# EAGLE design 64 channel Standard Array EIB v1.1 (EAGLE 9.6.2)
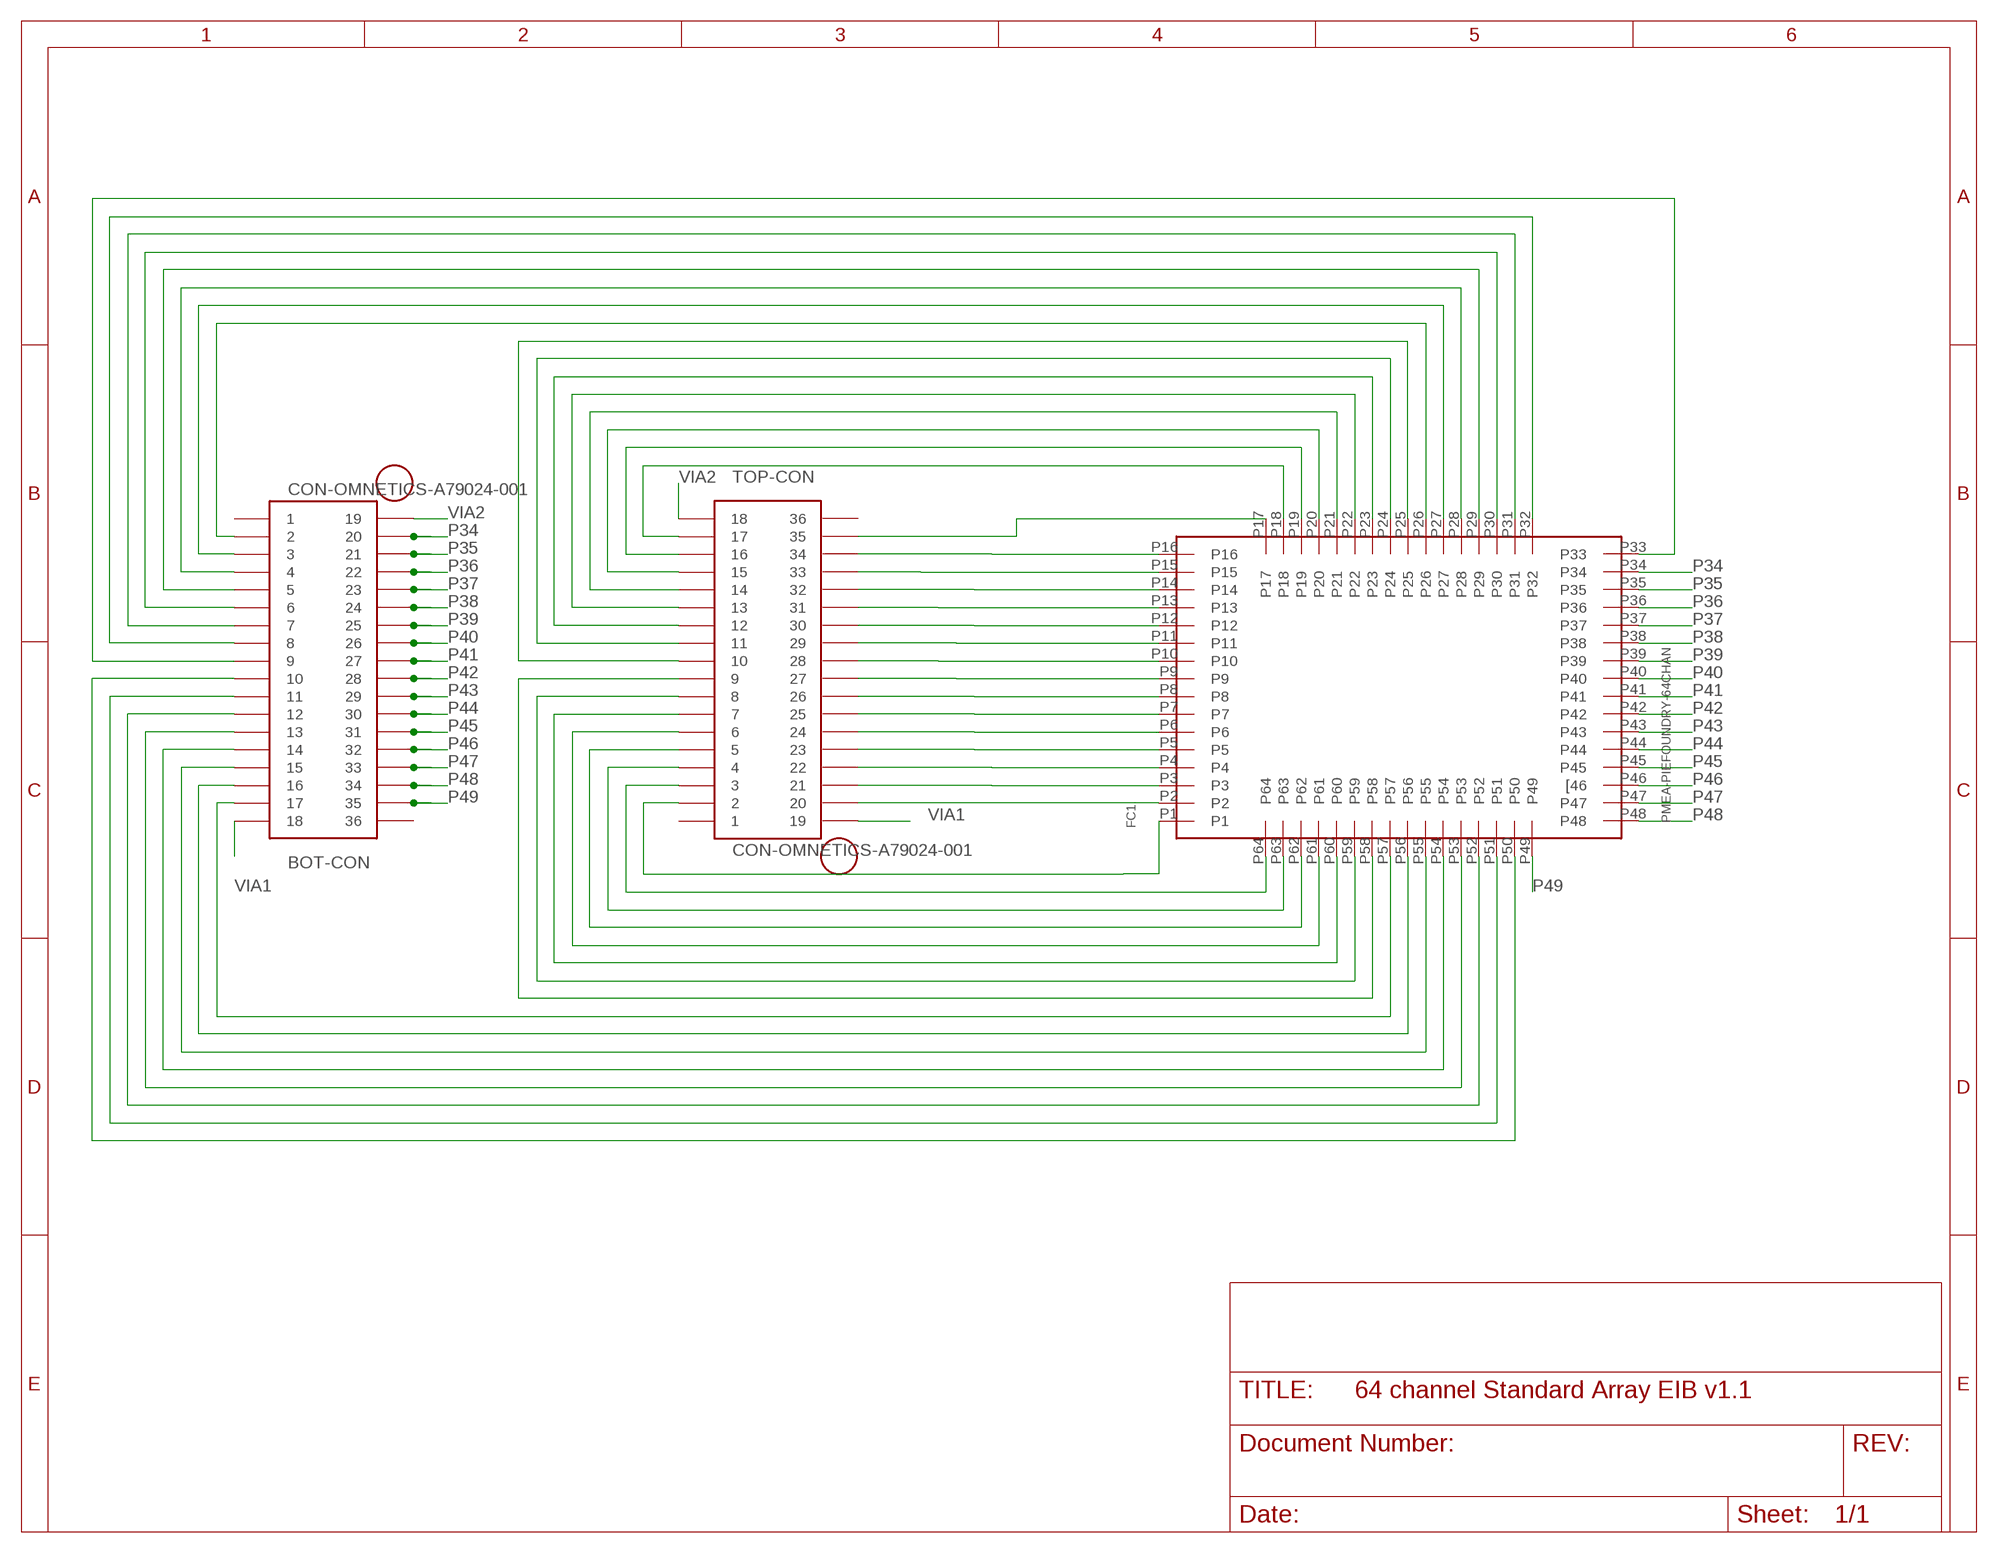
[diagram p0: schematic, sheet 1]

## Parts
BOT-CON  CON-OMNETICS-A79024-001  [CON-OMNETICS-A79024-001]
FC1  PMEA-PIEFOUNDRY-64CHAN  [PMEA-PIEFOUNDRY-64CHAN]
TOP-CON  CON-OMNETICS-A79024-001  [CON-OMNETICS-A79024-001]

## Nets
N$1: FC1.P17 TOP-CON.35
N$2: FC1.P16 TOP-CON.34
N$3: FC1.P15 TOP-CON.33
N$4: FC1.P14 TOP-CON.32
N$5: FC1.P13 TOP-CON.31
N$6: FC1.P12 TOP-CON.30
N$7: FC1.P11 TOP-CON.29
N$8: FC1.P10 TOP-CON.28
N$9: FC1.P9 TOP-CON.27
N$10: FC1.P8 TOP-CON.26
N$11: FC1.P7 TOP-CON.25
N$12: FC1.P6 TOP-CON.24
N$13: FC1.P5 TOP-CON.23
N$14: FC1.P4 TOP-CON.22
N$15: FC1.P3 TOP-CON.21
N$16: FC1.P2 TOP-CON.20
N$17: FC1.P18 TOP-CON.17
N$18: FC1.P19 TOP-CON.16
N$19: FC1.P20 TOP-CON.15
N$20: FC1.P21 TOP-CON.14
N$21: FC1.P22 TOP-CON.13
N$22: FC1.P23 TOP-CON.12
N$23: FC1.P24 TOP-CON.11
N$24: FC1.P25 TOP-CON.10
N$25: FC1.P1 TOP-CON.2
N$26: FC1.P64 TOP-CON.3
N$27: FC1.P63 TOP-CON.4
N$28: FC1.P62 TOP-CON.5
N$29: FC1.P61 TOP-CON.6
N$30: FC1.P60 TOP-CON.7
N$31: FC1.P59 TOP-CON.8
N$32: FC1.P58 TOP-CON.9
N$37: BOT-CON.2 FC1.P26
N$38: BOT-CON.3 FC1.P27
N$39: BOT-CON.4 FC1.P28
N$40: BOT-CON.5 FC1.P29
N$41: BOT-CON.6 FC1.P30
N$42: BOT-CON.7 FC1.P31
N$43: BOT-CON.8 FC1.P32
N$44: BOT-CON.9 FC1.P33
N$45: BOT-CON.17 FC1.P57
N$46: BOT-CON.16 FC1.P56
N$47: BOT-CON.15 FC1.P55
N$48: BOT-CON.14 FC1.P54
N$49: BOT-CON.13 FC1.P53
N$50: BOT-CON.12 FC1.P52
N$51: BOT-CON.11 FC1.P51
N$52: BOT-CON.10 FC1.P50
P34: BOT-CON.20 FC1.P34
P35: BOT-CON.21 FC1.P35
P36: BOT-CON.22 FC1.P36
P37: BOT-CON.23 FC1.P37
P38: BOT-CON.24 FC1.P38
P39: BOT-CON.25 FC1.P39
P40: BOT-CON.26 FC1.P40
P41: BOT-CON.27 FC1.P41
P42: BOT-CON.28 FC1.P42
P43: BOT-CON.29 FC1.P43
P44: BOT-CON.30 FC1.P44
P45: BOT-CON.31 FC1.P45
P46: BOT-CON.32 FC1.P46([46)
P47: BOT-CON.33 FC1.P47
P48: BOT-CON.34 FC1.P48
P49: BOT-CON.35 FC1.P49
VIA1: BOT-CON.18 TOP-CON.19
VIA2: BOT-CON.19 TOP-CON.18
Unconnected: BOT-CON.1 BOT-CON.36 TOP-CON.1 TOP-CON.36

## Library data of the parts
BOT-CON TOP-CON = con-omnetics:CON-OMNETICS-A79024-001: 36 Position Dual Row Male Nano-Miniature (.025″/.64mm) Connector; Featuring 4 Guide Posts and Horizontal Surface Mount Tails
FC1 = pmea-piefoundry:PMEA-PIEFOUNDRY-64CHAN: 64 channel polymer microelectrode array (pMEA) connector ; Connection requires 64 wirebond (soft-gold) pads for ultrasonic bump bonding; Legacy design maintained for compatibility with PIE Foundry Standard Array v1 3/25/25 Kee Scholten PIE Foundry @ USC

## Board
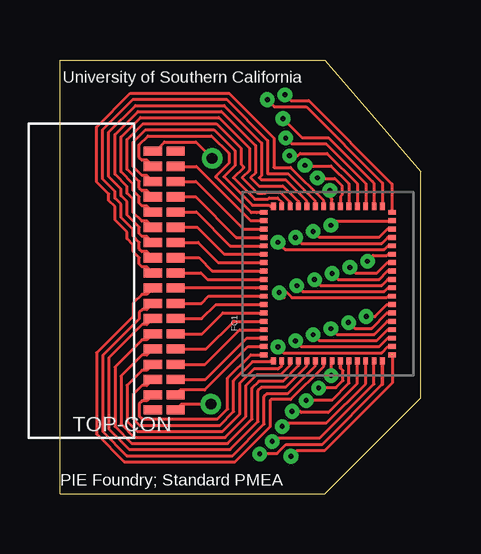
[diagram p1: board, top side]
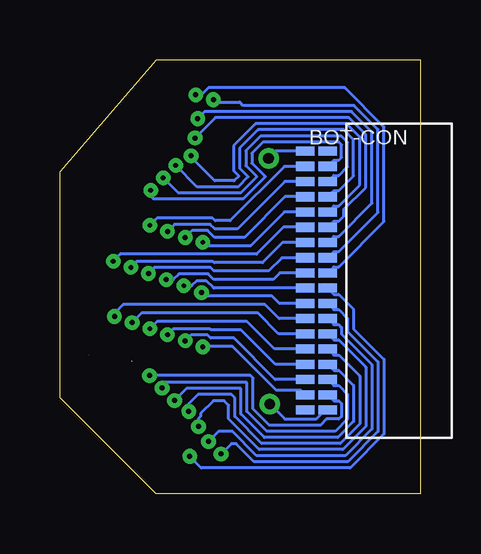
[diagram p2: board, bottom side, seen from below]

Size 15.05 x 18.1 mm. Coordinates in mm from the lower left corner, seen from the top.
Outline: 11.05,0 15.05,4 15.05,13.45 11.05,18.1 0,18.1 0,0 11.05,0
Copper layers (1*16): Top 0.035mm / dielectric 1.5mm / Bottom 0.035mm
Design rules "PIE-Probe *": minimum track width 5mil, minimum drill 8mil, track to track 5mil, track to pad 5mil, pad to pad 5mil, via to via 5mil, smd to smd 5mil, copper to edge 40mil, drill to drill 6mil, minimum pad ring 10mil, minimum via ring 8mil, stop-mask expansion 4mil, vias tented up to drill 0.3mm, thermal gap 10mil

### Footprints (pad centres in the part's own frame; a part is rotated, then mirrored left to right if it is on the bottom)
CON-OMNETICS-A79024-001 = smd 0.762 x 0.381: 1 1.88,-5.397; 2 1.88,-4.763; 3 1.88,-4.128; 4 1.88,-3.493; 5 1.88,-2.857; 6 1.88,-2.223; 7 1.88,-1.587; 8 1.88,-0.953; 9 1.88,-0.318; 10 1.88,0.318; 11 1.88,0.953; 12 1.88,1.587; 13 1.88,2.223; 14 1.88,2.857; 15 1.88,3.493; 16 1.88,4.128; 17 1.88,4.763; 18 1.88,5.397; 19 2.819,-5.397; 20 2.819,-4.763; 21 2.819,-4.128; 22 2.819,-3.493; 23 2.819,-2.857; 24 2.819,-2.223; 25 2.819,-1.587; 26 2.819,-0.953; 27 2.819,-0.318; 28 2.819,0.318; 29 2.819,0.953; 30 2.819,1.587; 31 2.819,2.223; 32 2.819,2.857; 33 2.819,3.493; 34 2.819,4.128; 35 2.819,4.763; 36 2.819,5.397
PMEA-PIEFOUNDRY-64CHAN = smd 0.2 x 0.3: P1 -2.975,2.675; P2 -2.625,2.675; P3 -2.275,2.675; P4 -1.925,2.675; P5 -1.575,2.675; P6 -1.225,2.675; P7 -0.875,2.675; P8 -0.525,2.675; P9 -0.175,2.675; P10 0.175,2.675; P11 0.525,2.675; P12 0.875,2.675; P13 1.225,2.675; P14 1.575,2.675; P15 1.925,2.675; P16 2.275,2.675; P17 2.625,2.675; P18 2.975,2.675; P33 2.975,-2.675; P34 2.625,-2.675; P35 2.275,-2.675; P36 1.925,-2.675; P37 1.575,-2.675; P38 1.225,-2.675; P39 0.875,-2.675; P40 0.525,-2.675; P41 0.175,-2.675; P42 -0.175,-2.675; P43 -0.525,-2.675; P44 -0.875,-2.675; P45 -1.225,-2.675; P46 -1.575,-2.675; P47 -1.925,-2.675; P48 -2.275,-2.675; P49 -2.625,-2.675; P50 -2.975,-2.675 | smd 0.3 x 0.2: P19 3.225,2.275; P20 3.225,1.925; P21 3.225,1.575; P22 3.225,1.225; P23 3.225,0.875; P24 3.225,0.525; P25 3.225,0.175; P26 3.225,-0.175; P27 3.225,-0.525; P28 3.225,-0.875; P29 3.225,-1.225; P30 3.225,-1.575; P31 3.225,-1.925; P32 3.225,-2.275; P51 -3.225,-2.275; P52 -3.225,-1.925; P53 -3.225,-1.575; P54 -3.225,-1.225; P55 -3.225,-0.875; P56 -3.225,-0.525; P57 -3.225,-0.175; P58 -3.225,0.175; P59 -3.225,0.525; P60 -3.225,0.875; P61 -3.225,1.225; P62 -3.225,1.575; P63 -3.225,1.925; P64 -3.225,2.275

### Placement (x,y rotation side)
BOT-CON  2,8.9 180 bottom
FC1  11.18,8.78 90 top
TOP-CON  2,8.9 0 top

### Tracks (layer width: path | path; a pad name or v marks a point on that pad's centre or on a via)
N$1
  Top 0.127: TOP-CON.35 5.69,13.66 7.95,11.4 FC1.P17
N$2
  Top 0.127: TOP-CON.34 5.67,13.03 7.65,11.05 FC1.P16
N$3
  Top 0.127: TOP-CON.33 5.66,12.39 7.35,10.7 FC1.P15
N$4
  Top 0.127: TOP-CON.32 5.69,11.76 7.1,10.35 FC1.P14
N$5
  Top 0.127: TOP-CON.31 5.73,11.12 6.85,10 FC1.P13
N$6
  Top 0.127: TOP-CON.30 5.76,10.49 6.6,9.65 FC1.P12
N$7
  Top 0.127: TOP-CON.29 5.8,9.85 6.35,9.3 FC1.P11
N$8
  Top 0.127: TOP-CON.28 5.88,9.22 6.15,8.95 FC1.P10
N$9
  Top 0.127: TOP-CON.27 8.18,8.58 8.48,8.58 FC1.P9
N$10
  Top 0.127: TOP-CON.26 5.9,7.95 6.2,8.25 FC1.P8
N$11
  Top 0.127: TOP-CON.25 5.91,7.31 6.5,7.9 FC1.P7
N$12
  Top 0.127: TOP-CON.24 5.93,6.68 6.8,7.55 FC1.P6
N$13
  Top 0.127: TOP-CON.23 6.09,6.04 7.25,7.2 FC1.P5
N$14
  Top 0.127: TOP-CON.22 6.06,5.41 7.45,6.8 7.5,6.85 FC1.P4
N$15
  Top 0.127: TOP-CON.21 6.07,4.77 7.8,6.5 FC1.P3
N$16
  Top 0.127: TOP-CON.20 5.02,4.34 6.04,4.34 7.85,6.15 FC1.P2
N$17
  Top 0.127: TOP-CON.17 3.63,13.92 3.42,13.92 3.31,14.03 3.31,14.57 3.67,14.93 6.32,14.93 7.04,14.21 7.04,13.79 6.5,13.25 6.5,13.21 7.98,11.73 8.2,11.73 8.48,11.73 FC1.P18
N$18
  Top 0.127: TOP-CON.16 3.63,13.28 3.42,13.28 3.05,13.65 3.05,14.67 3.57,15.19 6.42,15.19 7.3,14.31 7.3,13.69 6.84,13.23 8.03,12.04 8.73,12.04 8.77,12 FC1.P19
N$19
  Top 0.127: TOP-CON.15 3.63,12.65 3.42,12.65 3.31,12.76 3.31,13.03 2.8,13.54 2.8,14.78 3.46,15.44 6.53,15.44 7.55,14.42 7.55,13.75 7.65,13.65 7.65,13.6 7.24,13.19 8.13,12.29 8.68,12.29 8.72,12.34 9.08,12.34 9.25,12.17 FC1.P20
N$20
  Top 0.127: TOP-CON.14 3.63,12.01 3.42,12.01 3.31,12.12 3.31,12.4 3.05,12.65 3.05,12.93 2.55,13.44 2.55,14.88 3.36,15.69 6.63,15.69 7.9,14.42 7.9,13.49 7.6,13.19 8.24,12.55 8.57,12.55 8.62,12.6 9.18,12.6 9.6,12.18 FC1.P21
N$21
  Top 0.127: TOP-CON.13 3.63,11.38 3.42,11.38 3.05,11.74 3.05,12.29 2.8,12.55 2.8,12.82 2.29,13.33 2.29,14.99 3.25,15.95 6.74,15.95 8.16,14.53 8.16,13.39 7.96,13.19 8.3,12.85 9.3,12.85 9.95,12.2 FC1.P22
N$22
  Top 0.127: TOP-CON.12 3.63,10.74 3.42,10.74 3.31,10.85 3.31,11.13 2.8,11.64 2.8,12.19 2.55,12.44 2.55,12.72 2.04,13.23 2.04,15.09 3.15,16.2 6.84,16.2 8.41,14.63 8.41,13.28 8.32,13.19 8.4,13.1 9.4,13.1 10.3,12.21 FC1.P23
N$23
  Top 0.127: TOP-CON.11 3.63,10.11 3.42,10.11 3.31,10.22 3.31,10.49 3.05,10.75 3.05,11.02 2.55,11.53 2.55,12.08 2.29,12.34 2.29,12.61 1.78,13.12 1.78,15.2 3.04,16.46 6.95,16.46 8.67,14.74 8.67,13.36 9.51,13.36 10.65,12.22 FC1.P24
N$24
  Top 0.127: TOP-CON.10 3.63,9.47 3.42,9.47 3.31,9.58 3.31,9.86 3.05,10.11 3.05,10.39 2.8,10.64 2.8,10.92 2.29,11.43 2.29,11.98 2.04,12.23 2.04,12.51 1.53,13.02 1.53,15.3 2.94,16.71 7.05,16.71 8.92,14.85 8.92,13.61 9.62,13.61 11,12.22 FC1.P25
N$25
  Top 0.127: TOP-CON.2 3.63,3.88 3.42,3.88 3.31,3.77 3.31,3.23 3.42,3.12 6.57,3.12 7,3.54 7,4.84 7.96,5.8 FC1.P1
N$26
  Top 0.127: TOP-CON.3 3.63,4.52 3.42,4.52 3.05,4.15 3.05,3.13 3.31,2.87 6.68,2.87 7.25,3.44 7.25,4.73 8.03,5.51 8.75,5.51 | 8.86,5.51 8.75,5.51 | 8.75,5.51 8.79,5.55 FC1.P64
N$27
  Top 0.127: TOP-CON.4 3.63,5.15 3.42,5.15 2.8,4.53 2.8,3.02 3.21,2.61 6.78,2.61 7.5,3.33 7.5,4.63 8.09,5.21 9.09,5.21 9.25,5.37 FC1.P63
N$28
  Top 0.127: TOP-CON.5 3.63,5.79 3.42,5.79 2.55,4.92 2.55,2.92 3.1,2.36 6.89,2.36 7.76,3.23 7.76,4.52 8.19,4.96 9.19,4.96 9.6,5.36 FC1.P62
N$29
  Top 0.127: TOP-CON.6 3.63,6.42 3.42,6.42 2.29,5.3 2.29,2.81 3,2.11 6.99,2.11 8.01,3.12 8.01,4.42 8.3,4.7 9.3,4.7 9.95,5.35 FC1.P61
N$30
  Top 0.127: TOP-CON.7 3.63,7.06 3.42,7.06 2.04,5.68 2.04,2.71 2.89,1.85 7.1,1.85 8.27,3.02 8.27,4.31 8.4,4.45 9.4,4.45 10.3,5.34 FC1.P60
N$31
  Top 0.127: TOP-CON.8 3.63,7.69 3.42,7.69 3.31,7.58 3.31,7.31 1.78,5.78 1.78,2.6 2.79,1.6 7.2,1.6 8.52,2.91 8.52,4.06 8.65,4.19 9.51,4.19 10.65,5.33 FC1.P59
N$32
  Top 0.127: TOP-CON.9 3.63,8.33 3.42,8.33 3.05,7.96 3.05,7.41 1.53,5.89 1.53,2.5 2.68,1.34 7.31,1.34 8.77,2.81 8.77,3.91 8.8,3.94 9.62,3.94 11,5.33 FC1.P58
N$37  (via drill 0.2)
  Top 0.127: v11.26,12.66 11.26,12.37 11.35,12.29 FC1.P26
  Bottom 0.127: BOT-CON.2 3.63,13.92 3.42,13.92 3.31,14.03 3.31,14.57 3.42,14.68 6.57,14.68 7.04,14.21 7.04,13.79 6.5,13.25 6.5,13.21 7.41,12.3 11.15,12.3 11.26,12.41 v11.26,12.66
N$38  (via drill 0.2)
  Top 0.127: v10.74,13.18 10.77,13.16 11.47,13.16 11.76,12.87 11.76,12.46 11.7,12.4 FC1.P27
  Bottom 0.127: BOT-CON.3 3.63,13.28 3.42,13.28 3.05,13.65 3.05,14.67 3.31,14.93 6.68,14.93 7.3,14.31 7.3,13.69 6.84,13.23 7.51,12.55 10.11,12.55 v10.74,13.18
N$39  (via drill 0.2)
  Top 0.127: v10.22,13.71 10.25,13.68 11.31,13.68 12.05,12.94 FC1.P28
  Bottom 0.127: BOT-CON.4 3.63,12.65 3.42,12.65 2.8,13.27 2.8,14.78 3.21,15.19 6.78,15.19 7.55,14.42 7.55,13.58 7.2,13.23 7.62,12.81 9.32,12.81 v10.22,13.71
N$40  (via drill 0.2)
  Top 0.127: v9.58,14.11 9.92,14.11 10.02,14.2 11.14,14.2 12.4,12.95 FC1.P29
  Bottom 0.127: BOT-CON.5 3.63,12.01 3.42,12.01 2.55,12.88 2.55,14.88 3.1,15.44 6.89,15.44 7.81,14.52 7.81,13.48 7.59,13.26 7.79,13.06 8.6,13.06 9.58,14.04 v9.58,14.11
N$41  (via drill 0.2)
  Top 0.127: v9.41,14.84 9.66,14.6 11.1,14.6 12.75,12.95 FC1.P30
  Bottom 0.127: BOT-CON.6 3.63,11.38 3.42,11.38 3.2,11.6 3.2,11.87 2.29,12.78 2.29,14.99 3,15.69 8.56,15.69 v9.41,14.84
N$42  (via drill 0.2)
  Top 0.127: v9.3,15.65 10.1,14.86 11.21,14.86 13.03,13.03 13.1,12.96 FC1.P31
  Bottom 0.127: BOT-CON.7 3.63,10.74 3.42,10.74 2.04,12.12 2.04,15.09 2.89,15.95 9.01,15.95 v9.3,15.65
N$43  (via drill 0.2)
  Top 0.127: v8.65,16.44 8.94,16.15 10.27,16.15 13.45,12.97 FC1.P32
  Bottom 0.127: BOT-CON.8 3.63,10.11 3.42,10.11 1.78,11.74 1.78,15.2 2.79,16.2 7.41,16.2 7.55,16.34 8.55,16.34 v8.65,16.44
N$44  (via drill 0.2)
  Top 0.127: v9.39,16.64 9.63,16.4 10.38,16.4 13.85,12.93 FC1.P33
  Bottom 0.127: BOT-CON.9 3.63,9.47 3.42,9.47 1.53,11.36 1.53,15.3 3.17,16.94 8.86,16.94 9.15,16.64 v9.39,16.64
N$45  (via drill 0.2)
  Top 0.127: 11.35,4.97 v11.31,4.94 11.31,5.51 FC1.P57
  Bottom 0.127: BOT-CON.17 3.63,3.88 3.42,3.88 3.31,3.77 3.31,3.23 3.42,3.12 3.93,3.12 4.18,2.87 6.32,2.87 7,3.54 7,4.84 7.1,4.94 v11.31,4.94
N$46  (via drill 0.2)
  Top 0.127: v10.79,4.42 10.82,4.44 11.52,4.44 11.81,4.73 11.81,5.14 11.7,5.25
  Top 0.152: 11.7,5.25 FC1.P56
  Bottom 0.127: BOT-CON.16 3.63,4.52 3.42,4.52 3.05,4.15 3.05,3.13 3.57,2.61 6.42,2.61 7.25,3.44 7.25,4.65 10.7,4.65 10.79,4.56 v10.79,4.42
N$47  (via drill 0.2)  (1 unrouted)
  Top 0.127: 12.06,5.54 12.06,4.63 11.36,3.92 10.3,3.92 v10.27,3.9
  Bottom 0.127: BOT-CON.15 3.63,5.15 3.42,5.15 2.8,4.53 2.8,3.02 3.46,2.36 6.53,2.36 7.5,3.33 7.5,4.4 9.77,4.4 v10.27,3.9
N$48  (via drill 0.2)
  Top 0.127: v9.68,3.44 10.02,3.44 10.07,3.4 11.2,3.4 12.4,4.61 FC1.P54
  Bottom 0.127: BOT-CON.14 3.63,5.79 3.42,5.79 2.55,4.92 2.55,2.92 3.36,2.11 6.63,2.11 7.76,3.23 7.76,4 7.9,4.14 9.3,4.14 9.68,3.76 v9.68,3.44
N$49  (via drill 0.2)
  Top 0.127: v9.27,2.81 9.4,2.95 11.1,2.95 12.75,4.6 FC1.P53
  Bottom 0.127: BOT-CON.13 3.63,6.42 3.42,6.42 2.29,5.3 2.29,2.81 3.25,1.85 6.74,1.85 8.01,3.12 8.01,3.7 8.2,3.89 8.65,3.89 9.19,3.35 9.19,3.24 9.27,3.16 v9.27,2.81
N$50  (via drill 0.2)
  Top 0.127: v8.85,2.19 8.98,2.32 10.83,2.32 13.1,4.59 FC1.P52
  Bottom 0.127: BOT-CON.12 3.63,7.06 3.42,7.06 3.31,6.95 3.31,6.67 2.04,5.4 2.04,2.71 3.15,1.6 6.84,1.6 7.85,2.6 8.44,2.6 v8.85,2.19
N$51  (via drill 0.2)
  Top 0.127: v8.33,1.67 8.36,1.69 9.06,1.69 9.43,2.06 10.94,2.06 13.44,4.56
  Top 0.152: 13.44,4.56 13.45,4.58 FC1.P51
  Bottom 0.127: BOT-CON.11 3.63,7.69 3.42,7.69 3.05,7.33 3.05,6.78 1.78,5.51 1.78,2.6 3.04,1.34 6.95,1.34 7.7,2.1 7.9,2.1 v8.33,1.67
N$52  (via drill 0.2)  (1 unrouted)
  Top 0.127: v9.64,1.57 9.88,1.81 11.04,1.81 13.86,4.63 FC1.P50
  Bottom 0.127: BOT-CON.10 3.63,8.33 3.42,8.33 2.8,7.71 2.8,6.88 1.53,5.61 1.53,2.5 2.94,1.09 9.16,1.09 v9.64,1.57
P34  (via drill 0.2)
  Top 0.127: v11.3,11.2 11.48,11.39 13.84,11.39 FC1.P34
  Bottom 0.127: BOT-CON.20 5.69,13.66 7.95,11.4 8.58,11.4 8.68,11.5 11.01,11.5 v11.3,11.2
P35  (via drill 0.2)
  Top 0.127: v10.56,10.95 10.81,10.71 13.32,10.71 13.66,11.05 FC1.P35
  Bottom 0.127: BOT-CON.21 5.67,13.03 7.65,11.05 8.59,11.05 8.78,11.24 10.27,11.24 v10.56,10.95
P36  (via drill 0.2)
  Top 0.127: v9.83,10.7 10.07,10.45 13.43,10.45 13.67,10.7 FC1.P36
  Bottom 0.127: BOT-CON.22 5.66,12.39 7.35,10.7 8.6,10.7 8.89,10.99 9.53,10.99 v9.83,10.7
P37  (via drill 0.2)
  Top 0.127: v9.09,10.49 9.39,10.2 13.53,10.2 13.68,10.35 FC1.P37
  Bottom 0.127: BOT-CON.23 5.69,11.76 7.1,10.35 8.95,10.35 v9.09,10.49
P38  (via drill 0.2)
  Top 0.127: FC1.P38 13.69,10 13.64,9.95 13.07,9.95 v12.83,9.7
  Bottom 0.127: BOT-CON.24 5.73,11.12 6.85,10 12.53,10 v12.83,9.7
P39  (via drill 0.2)
  Top 0.127: v12.09,9.45 12.33,9.21 13.21,9.21 13.65,9.65 FC1.P39
  Bottom 0.127: BOT-CON.25 5.76,10.49 6.6,9.65 8.62,9.65 8.66,9.69 11.85,9.69 v12.09,9.45
P40  (via drill 0.2)
  Top 0.127: v11.36,9.19 11.6,8.95 13.31,8.95 13.66,9.3 FC1.P40
  Bottom 0.127: BOT-CON.26 5.8,9.85 6.35,9.3 8.63,9.3 8.77,9.44 11.11,9.44 v11.36,9.19
P41  (via drill 0.2)
  Top 0.127: v10.62,8.94 10.86,8.7 13.42,8.7 13.67,8.95 FC1.P41
  Bottom 0.127: BOT-CON.27 5.88,9.22 6.15,8.95 8.64,8.95 8.87,9.18 10.09,9.18 10.33,8.94 v10.62,8.94
P42  (via drill 0.2)
  Top 0.127: v9.88,8.69 10.12,8.44 13.53,8.44 13.68,8.6 FC1.P42
  Bottom 0.127: BOT-CON.28 8.63,8.58 8.65,8.6 | 8.65,8.6 | 8.65,8.6 8.94,8.89 9.35,8.89 9.55,8.69 v9.88,8.69
P43  (via drill 0.2)
  Top 0.127: 9.35,8.19 v9.14,8.39 9.47,8.39 9.68,8.19 13.63,8.19 13.69,8.25 FC1.P43
  Bottom 0.127: BOT-CON.29 5.9,7.95 6.2,8.25 9,8.25 v9.14,8.39
P44  (via drill 0.2)
  Top 0.127: v12.78,7.4 13.14,7.4 13.63,7.9 FC1.P44
  Bottom 0.127: BOT-CON.30 5.91,7.31 6.5,7.9 12.4,7.9 12.78,7.53 v12.78,7.4
P45  (via drill 0.2)
  Top 0.127: v12.04,7.15 12.05,7.15 12.29,6.91 13,6.91 13.64,7.55 FC1.P45
  Bottom 0.127: BOT-CON.31 5.93,6.68 6.8,7.55 11.64,7.55 v12.04,7.15
P46  (via drill 0.2)
  Top 0.127: v11.3,6.89 11.54,6.65 13.11,6.65 13.65,7.2 FC1.P46
  Bottom 0.127: BOT-CON.32 6.1,6.05 7.25,7.2 10.99,7.2 v11.3,6.89
P47  (via drill 0.2)
  Top 0.127: v10.56,6.64 10.81,6.4 13.21,6.4 13.66,6.85 FC1.P47
  Bottom 0.127: BOT-CON.33 6.06,5.41 7.5,6.85 8.75,6.85 8.78,6.88 10.32,6.88 v10.56,6.64
P48  (via drill 0.2)
  Top 0.127: v9.83,6.39 10.07,6.14 13.32,6.14 13.67,6.5 FC1.P48
  Bottom 0.127: BOT-CON.34 6.07,4.77 7.8,6.5 8.76,6.5 8.89,6.63 9.59,6.63 v9.83,6.39
P49  (via drill 0.2)
  Top 0.127: v9.09,6.13 9.33,5.89 13.42,5.89 13.68,6.15 FC1.P49
  Bottom 0.127: BOT-CON.35 5.02,4.34 6.04,4.34 7.85,6.15 9.07,6.15 v9.09,6.13
VIA1  (via drill 0.45)
  Top 0.127: TOP-CON.19 5.07,3.75 v6.3,3.75
  Bottom 0.127: BOT-CON.18 3.98,3.5 4.36,3.12 5.67,3.12 v6.3,3.75
VIA2  (via drill 0.45)
  Top 0.127: TOP-CON.18 3.98,14.3 4.36,14.68 5.67,14.68 v6.35,14
  Bottom 0.127: BOT-CON.19 6.05,14.3 v6.35,14

### Text on the board
tPlace: University of Southern California | PIE Foundry; Standard PMEA